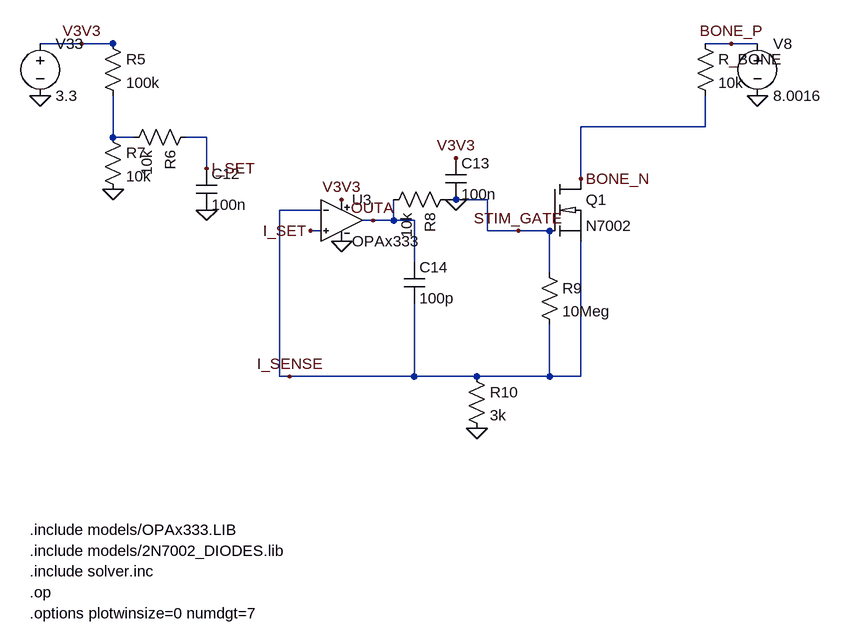
[diagram p0: schematic sink_vendor.asc]
sink_vendor.asc, the LTspice schematic file:
Version 4.1
SHEET 1 1704 1200
SYMBOL res 312 396 R0
SYMATTR InstName R5
SYMATTR Value 100k
SYMBOL res 312 540 R0
SYMATTR InstName R7
SYMATTR Value 10k
WIRE 328 492 328 556
SYMBOL res 456 540 R90
SYMATTR InstName R6
SYMATTR Value 10k
WIRE 328 556 360 556
SYMBOL cap 456 604 R0
SYMATTR InstName C12
SYMATTR Value 100n
WIRE 440 556 472 556
WIRE 472 556 472 604
FLAG 472 604 I_SET
FLAG 472 668 0
FLAG 328 636 0
SYMBOL voltage 216 396 R0
SYMATTR InstName V33
SYMATTR Value 3.3
WIRE 216 412 328 412
WIRE 328 412 328 412
FLAG 216 492 0
FLAG 280 412 V3V3
SYMBOL OPAx333 680 620 R0
SYMATTR InstName U3
SYMATTR Value OPAx333
WIRE 648 700 632 700
FLAG 632 700 I_SET
FLAG 680 652 V3V3
FLAG 680 716 0
SYMBOL cap 840 588 R0
SYMATTR InstName C13
SYMATTR Value 100n
FLAG 856 588 V3V3
FLAG 856 652 0
WIRE 712 684 760 684
WIRE 760 684 792 684
FLAG 728 684 OUTA
SYMBOL res 856 636 R90
SYMATTR InstName R8
SYMATTR Value 10k
WIRE 760 652 760 684
SYMBOL cap 776 748 R0
SYMATTR InstName C14
SYMATTR Value 100p
WIRE 792 684 792 748
WIRE 792 812 792 924
SYMBOL N7002 1000 620 R0
SYMATTR InstName Q1
SYMATTR Value N7002
WIRE 840 652 904 652
WIRE 904 652 904 700
WIRE 904 700 1000 700
FLAG 952 700 STIM_GATE
FLAG 1048 620 BONE_N
SYMBOL res 984 748 R0
SYMATTR InstName R9
SYMATTR Value 10Meg
WIRE 1000 700 1000 764
WIRE 1000 844 1000 924
WIRE 1048 716 1048 924
SYMBOL res 872 908 R0
SYMATTR InstName R10
SYMATTR Value 3k
FLAG 888 1004 0
WIRE 648 668 584 668
WIRE 584 668 584 924
WIRE 584 924 792 924
WIRE 792 924 888 924
WIRE 888 924 1000 924
WIRE 1000 924 1048 924
FLAG 600 924 I_SENSE
SYMBOL res 1224 396 R0
SYMATTR InstName R_BONE
SYMATTR Value 10k
SYMBOL voltage 1320 396 R0
SYMATTR InstName V8
SYMATTR Value 8.0016
WIRE 1240 412 1320 412
FLAG 1320 492 0
FLAG 1280 412 BONE_P
WIRE 1240 492 1240 540
WIRE 1240 540 1048 540
WIRE 1048 540 1048 620
TEXT 200 1160 Left 2 !.include models/OPAx333.LIB
TEXT 200 1192 Left 2 !.include models/2N7002_DIODES.lib
TEXT 200 1224 Left 2 !.include solver.inc
TEXT 200 1256 Left 2 !.op
TEXT 200 1288 Left 2 !.options plotwinsize=0 numdgt=7

The netlist it stands for:
* sink_vendor.asc
R5 V3V3 N001 100k
R7 N001 0 10k
R6 I_SET N001 10k
C12 I_SET 0 100n
V33 V3V3 0 3.3
X§U3 I_SET I_SENSE V3V3 0 OUTA OPAx333  ; pins In+ In- V+ V- OUT
C13 V3V3 0 100n
R8 0 OUTA 10k
C14 OUTA I_SENSE 100p
X§Q1 BONE_N 0 I_SENSE N7002  ; pins D G S
R9 0 I_SENSE 10Meg
R10 I_SENSE 0 3k
R_BONE BONE_P BONE_N 10k
V8 BONE_P 0 8.0016
.include models/OPAx333.LIB
.include models/2N7002_DIODES.lib
.include solver.inc
.op
.options plotwinsize=0 numdgt=7
.backanno
.end